# EAGLE design quantizer-main (EAGLE 6.6.0)
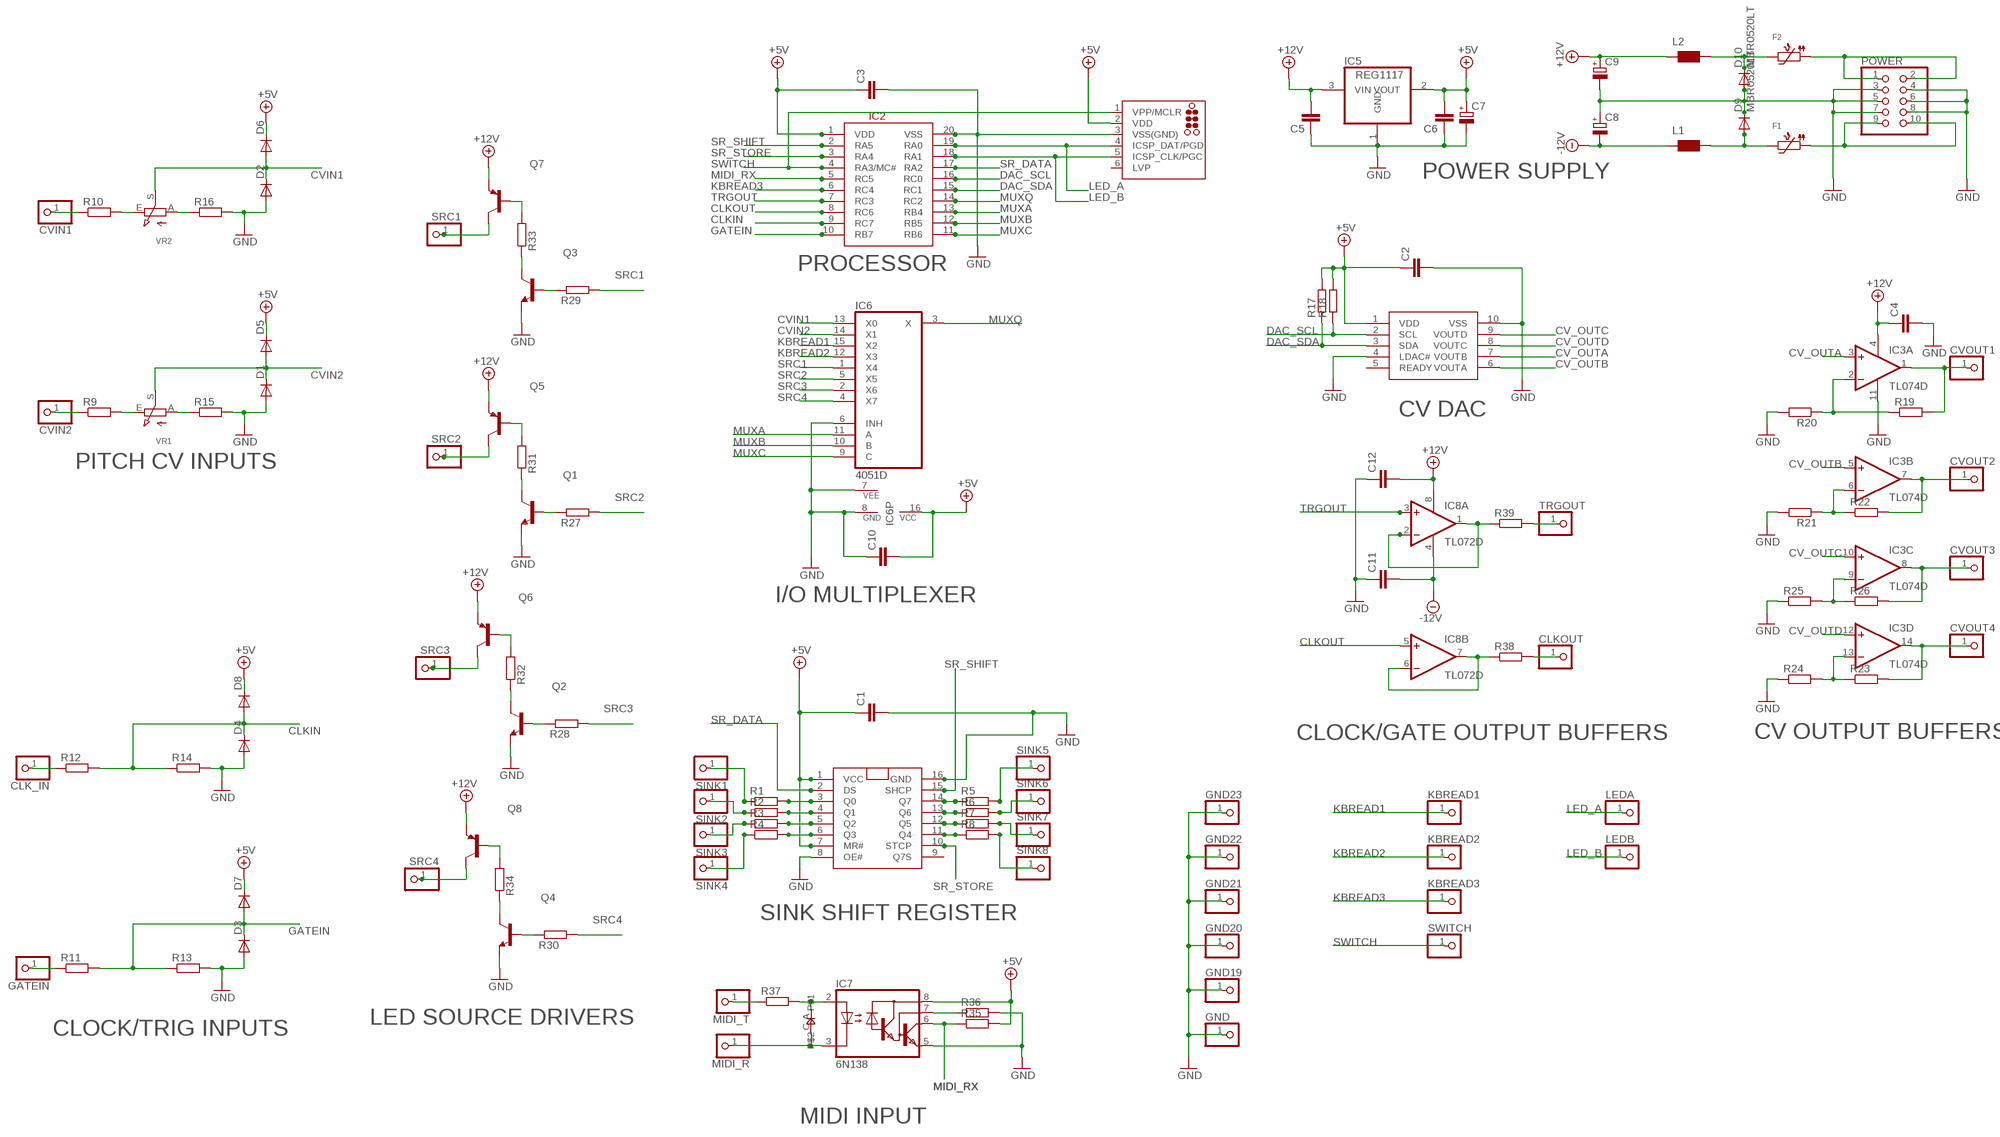
[diagram p0: schematic, sheet 1]

## Parts
C1  C-EUC0805  [C0805]
C2  C-EUC0805  [C0805]
C3  C-EUC0805  [C0805]
C4  C-EUC0805  [C0805]
C5  C-EUC0805  [C0805]
C6  C-EUC0805  [C0805]
C7  CPOL-EUE2.5-5  [E2,5-5]
C8  CPOL-EUE2.5-7  [E2,5-7]
C9  CPOL-EUE2.5-7  [E2,5-7]
C10  C-EUC0805  [C0805]
C11  C-EUC0805  [C0805]
C12  C-EUC0805  [C0805]
CLK_IN  PINHD-1X1  [1X01]
CLKOUT  PINHD-1X1  [1X01]
CVIN1  PINHD-1X1  [1X01]
CVIN2  PINHD-1X1  [1X01]
CVOUT1  PINHD-1X1  [1X01]
CVOUT2  PINHD-1X1  [1X01]
CVOUT3  PINHD-1X1  [1X01]
CVOUT4  PINHD-1X1  [1X01]
D1  DIODE-SOD123  [SOD123]
D2  DIODE-SOD123  [SOD123]
D3  DIODE-SOD123  [SOD123]
D4  DIODE-SOD123  [SOD123]
D5  DIODE-SOD123  [SOD123]
D6  DIODE-SOD123  [SOD123]
D7  DIODE-SOD123  [SOD123]
D8  DIODE-SOD123  [SOD123]
D9  MBR0520LT  [SOD123]
D10  MBR0520LT  [SOD123]
D11  0805DIODE  [0805DIODE]
F1  PTC1210  [PTC1210]
F2  PTC1210  [PTC1210]
GATEIN  PINHD-1X1  [1X01]
GND  PINHD-1X1  [1X01]
GND19  PINHD-1X1  [1X01]
GND20  PINHD-1X1  [1X01]
GND21  PINHD-1X1  [1X01]
GND22  PINHD-1X1  [1X01]
GND23  PINHD-1X1  [1X01]
IC1  NPIC6C596  [SO16]
IC2  PIC16F1829SOIC  [SO20W]
IC3  TL074D  [SO14]
IC4  MCP4728_QUAD_DAC  [MSOP10]
IC5  REG1117  [SOT223]
IC6  4051D  [SO16]
IC7  6N138  [DIL08]
IC8  TL072D  [SO08]
J1  TC2030-MCP-NL  [TC2030-MCP-NL]
KBREAD1  PINHD-1X1  [1X01]
KBREAD2  PINHD-1X1  [1X01]
KBREAD3  PINHD-1X1  [1X01]
L1  WE-CBF_0805  [0805]
L2  WE-CBF_0805  [0805]
LEDA  PINHD-1X1  [1X01]
LEDB  PINHD-1X1  [1X01]
MIDI_R  PINHD-1X1  [1X01]
MIDI_T  PINHD-1X1  [1X01]
POWER  PINHD-2X5  [2X05]
Q1  MMBT3904LT1-NPN-SOT23-BEC  [SOT23-BEC]
Q2  MMBT3904LT1-NPN-SOT23-BEC  [SOT23-BEC]
Q3  MMBT3904LT1-NPN-SOT23-BEC  [SOT23-BEC]
Q4  MMBT3904LT1-NPN-SOT23-BEC  [SOT23-BEC]
Q5  MMBT3906LT1-PNP-SOT23-BEC  [SOT23-BEC]
Q6  MMBT3906LT1-PNP-SOT23-BEC  [SOT23-BEC]
Q7  MMBT3906LT1-PNP-SOT23-BEC  [SOT23-BEC]
Q8  MMBT3906LT1-PNP-SOT23-BEC  [SOT23-BEC]
R1  R-EU_R0805  [R0805]
R2  R-EU_R0805  [R0805]
R3  R-EU_R0805  [R0805]
R4  R-EU_R0805  [R0805]
R5  R-EU_R0805  [R0805]
R6  R-EU_R0805  [R0805]
R7  R-EU_R0805  [R0805]
R8  R-EU_R0805  [R0805]
R9  R-EU_R0805  [R0805]
R10  R-EU_R0805  [R0805]
R11  R-EU_R0805  [R0805]
R12  R-EU_R0805  [R0805]
R13  R-EU_R0805  [R0805]
R14  R-EU_R0805  [R0805]
R15  R-EU_R0805  [R0805]
R16  R-EU_R0805  [R0805]
R17  R-EU_R0805  [R0805]
R18  R-EU_R0805  [R0805]
R19  R-EU_R0805  [R0805]
R20  R-EU_R0805  [R0805]
R21  R-EU_R0805  [R0805]
R22  R-EU_R0805  [R0805]
R23  R-EU_R0805  [R0805]
R24  R-EU_R0805  [R0805]
R25  R-EU_R0805  [R0805]
R26  R-EU_R0805  [R0805]
R27  R-EU_R0805  [R0805]
R28  R-EU_R0805  [R0805]
R29  R-EU_R0805  [R0805]
R30  R-EU_R0805  [R0805]
R31  R-EU_R0805  [R0805]
R32  R-EU_R0805  [R0805]
R33  R-EU_R0805  [R0805]
R34  R-EU_R0805  [R0805]
R35  R-EU_R0805  [R0805]
R36  R-EU_R0805  [R0805]
R37  R-EU_R0805  [R0805]
R38  R-EU_R0805  [R0805]
R39  R-EU_R0805  [R0805]
SINK1  PINHD-1X1  [1X01]
SINK2  PINHD-1X1  [1X01]
SINK3  PINHD-1X1  [1X01]
SINK4  PINHD-1X1  [1X01]
SINK5  PINHD-1X1  [1X01]
SINK6  PINHD-1X1  [1X01]
SINK7  PINHD-1X1  [1X01]
SINK8  PINHD-1X1  [1X01]
SRC1  PINHD-1X1  [1X01]
SRC2  PINHD-1X1  [1X01]
SRC3  PINHD-1X1  [1X01]
SRC4  PINHD-1X1  [1X01]
SWITCH  PINHD-1X1  [1X01]
TRGOUT  PINHD-1X1  [1X01]
VR1  TRIMPOT10K_BOURNS  [TRIMPOT_BOURNS3MM]
VR2  TRIMPOT10K_BOURNS  [TRIMPOT_BOURNS3MM]

## Nets
+5V: C1.1 C2.1 C3.1 C6.2 C7.+ C10.2 D5.C D6.C D7.C D8.C IC1.1(VCC) IC1.7(MR#) IC2.1(VDD) IC4.1(VDD) IC5.2(VOUT) IC6.16(VCC) IC7.8(VCC) J1.2(VDD) R17.2 R18.2 R35.2
+12V: C4.1 C5.2 C9.+ C12.2 IC3.4(P:V+) IC5.3(VIN) IC8.8(P:V+) L2.1 Q5.E Q6.E Q7.E Q8.E
-12V: C8.- C11.2 IC8.4(P:V-) L1.1
CLKIN: D4.C D8.A IC2.9(RC7) R12.2 R14.1
CLKOUT: IC2.8(RC6) IC8.5(B:+IN)
CV_OUTA: IC3.3(A:+IN) IC4.7(VOUTB)
CV_OUTB: IC3.5(B:+IN) IC4.6(VOUTA)
CV_OUTC: IC3.10(C:+IN) IC4.9(VOUTD)
CV_OUTD: IC3.12(D:+IN) IC4.8(VOUTC)
CVIN1: D2.C D6.A IC6.13(X0) VR2.S
CVIN2: D1.C D5.A IC6.14(X1) VR1.S
DAC_SCL: IC2.16(RC0) IC4.2(SCL) R18.1
DAC_SDA: IC2.15(RC1) IC4.3(SDA) R17.1
GATEIN: D3.C D7.A IC2.10(RB7) R11.2 R13.1
GND: C1.2 C2.2 C3.2 C4.2 C5.1 C6.1 C7.- C8.+ C9.- C10.1 C11.1 C12.1 D1.A D2.A D3.A D4.A D9.C D10.A GND19.1 GND20.1 GND21.1 GND22.1 GND23.1 GND.1 IC1.8(OE#) IC1.16(GND) IC2.20(VSS) IC3.11(P:V-) IC4.4(LDAC#) IC4.10(VSS) IC5.1(GND) IC6.6(INH) IC6.7(VEE) IC6.8(GND) IC7.5(GND) J1.3(VSS(GND)) POWER.3 POWER.4 POWER.5 POWER.6 POWER.7 POWER.8 Q1.E Q2.E Q3.E Q4.E R13.2 R14.2 R15.2 R16.2 R20.2 R21.2 R24.1 R25.1 R36.2
KBREAD1: IC6.15(X2) KBREAD1.1
KBREAD2: IC6.12(X3) KBREAD2.1
KBREAD3: IC2.6(RC4) KBREAD3.1
LED_A: IC2.19(RA0) J1.4(ICSP_DAT/PGD) LEDA.1
LED_B: IC2.18(RA1) J1.5(ICSP_CLK/PGC) LEDB.1
MIDI_RX: IC2.5(RC5) IC7.6(VO) R35.1
MUXA: IC2.13(RB4) IC6.11(A)
MUXB: IC2.12(RB5) IC6.10(B)
MUXC: IC2.11(RB6) IC6.9(C)
MUXQ: IC2.14(RC2) IC6.3(X)
N$1: CVOUT1.1 IC3.1(A:OUT) R19.2
N$2: IC3.2(A:-IN) R19.1 R20.1
N$3: R1.1 SINK1.1
N$4: IC3.6(B:-IN) R21.1 R22.1
N$5: CVOUT2.1 IC3.7(B:OUT) R22.2
N$6: R2.1 SINK2.1
N$7: R3.1 SINK3.1
N$8: R4.1 SINK4.1
N$9: CVOUT3.1 IC3.8(C:OUT) R26.2
N$10: CVOUT4.1 IC3.14(D:OUT) R23.2
N$11: IC3.9(C:-IN) R25.2 R26.1
N$12: IC3.13(D:-IN) R23.1 R24.2
N$13: IC1.3(Q0) R1.2
N$14: IC1.4(Q1) R2.2
N$15: IC1.5(Q2) R3.2
N$16: IC1.6(Q3) R4.2
N$17: R5.2 SINK5.1
N$18: R6.2 SINK6.1
N$19: R7.2 SINK7.1
N$20: R8.2 SINK8.1
N$21: IC1.14(Q7) R5.1
N$22: IC1.13(Q6) R6.1
N$23: IC1.12(Q5) R7.1
N$24: IC1.11(Q4) R8.1
N$25: Q7.C SRC1.1
N$26: Q3.B R29.1
N$27: MIDI_T.1 R37.1
N$28: Q7.B R33.2
N$29: Q5.C SRC2.1
N$30: Q1.B R27.1
N$31: D11.A IC7.2(A) R37.2
N$32: Q3.C R33.1
N$33: Q5.B R31.2
N$34: Q1.C R31.1
N$35: D11.C IC7.3(C) MIDI_R.1
N$36: Q6.C SRC3.1
N$37: Q2.B R28.1
N$38: Q6.B R32.2
N$39: Q2.C R32.1
N$40: Q8.C SRC4.1
N$41: D10.C F2.P$2 L2.2
N$42: D9.A F1.P$2 L1.2
N$44: Q4.B R30.1
N$45: Q8.B R34.2
N$46: CLK_IN.1 R12.1
N$47: IC7.7(VB) R36.1
N$48: Q4.C R34.1
N$50: GATEIN.1 R11.1
N$53: CVIN2.1 R9.1
N$54: R9.2 VR1.E
N$55: R15.1 VR1.A
N$56: CVIN1.1 R10.1
N$57: R10.2 VR2.E
N$58: R16.1 VR2.A
N$60: IC8.1(A:OUT) IC8.2(A:-IN) R39.1
N$61: IC8.6(B:-IN) IC8.7(B:OUT) R38.1
N$63: F1.P$1 POWER.9 POWER.10
N$64: R39.2 TRGOUT.1
N$65: CLKOUT.1 R38.2
N$75: F2.P$1 POWER.1 POWER.2
SR_DATA: IC1.2(DS) IC2.17(RA2)
SR_SHIFT: IC1.15(SHCP) IC2.2(RA5)
SR_STORE: IC1.10(STCP) IC2.3(RA4)
SRC1: IC6.1(X4) R29.2
SRC2: IC6.5(X5) R27.2
SRC3: IC6.2(X6) R28.2
SRC4: IC6.4(X7) R30.2
SWITCH: IC2.4(RA3/MC#) J1.1(VPP/MCLR) SWITCH.1
TRGOUT: IC2.7(RC3) IC8.3(A:+IN)
Unconnected: IC1.9(Q7S) IC4.5(READY) J1.6(LVP)

## Notes on the sheet
- POWER SUPPLY
- PROCESSOR
- CV DAC
- PITCH CV INPUTS
- I/O MULTIPLEXER
- CLOCK/GATE OUTPUT BUFFERS | CV OUTPUT BUFFERS
- SINK SHIFT REGISTER
- LED SOURCE DRIVERS
- CLOCK/TRIG INPUTS
- MIDI INPUT

## Library data of the parts
C1-C6 C10-C12 = rcl:C-EU: CAPACITOR, European symbol
C7-C9 = rcl:CPOL-EU: POLARIZED CAPACITOR, European symbol
CLK_IN CLKOUT CVIN1 CVIN2 CVOUT1-CVOUT4 GATEIN GND GND19-GND23 KBREAD1-KBREAD3 LEDA LEDB MIDI_R MIDI_T SINK1-SINK8 SRC1-SRC4 SWITCH TRGOUT = pinhead:PINHD-1X1: PIN HEADER
D1-D8 = diode:DIODE-: DIODE
D9 D10 = diode:MBR0520LT: SCHOTTKY BARRIER RECTIFIER Source: http://onsemi.com .. MBR0520LT1-D.pdf
D11 = jasons_stuff:0805DIODE
F1 F2 = microbuilder:PTC: PTC (Resettable Fuse) 1206 Package 250mA PTC (16V Max, Time-to-Trip: 0.08s) - Digikey: F2110CT-ND 1210 Package 100mA PTC (30V Max, Time-to-Trip: 0.6s) - Digikey: MF-USMF010-2CT-ND 1812 Package 750mA PTC (24V Max, Time-to-Trip: 0.2s) - Digikey: MF-MSMF075/24-2CT-ND
IC1 = jasons_stuff:NPIC6C596
IC2 = jason_eagle6:PIC16F1829
IC3 = linear:TL074: OP AMP
IC4 = jason_eagle6:MCP4728_QUAD_DAC
IC5 = burr-brown:REG1117: 800mA and 1A Low Dropout (LDO) Positive Regulator 1.8V, 2.5V, 2.85V, 3.3V, 5V, and Adj; MPN: REG1117; OC_FARNELL: 1097566; OC_NEWARK: 14P6981
IC6 = 40xx:4051: 8-channel ANALOG MULTIPLEXER
IC7 = optocoupler:6N138: MOTOROLA OPTO COUPLER; MF: VISHAY/TELEFUNKEN; MPN: 6N138; OC_FARNELL: 9860150; OC_NEWARK: 35K5294
IC8 = linear:TL072: OP AMP
J1 = tag-connect:TC2030: TAG-CONNECT ICSP Connector Manufacturer: Tag-Connect <http://www.tag-connect.com> Cable for easy In-Circuit Serial Programming. Designed for Microchip ICD2, suitable for many others. Two variants - one "with legs" (for hands-free fit on PCB) and another "without legs" for quick programming. PAD Description 1 MCLR/Vpp 2 Vdd 3 GND 4 PGD (ISPDAT) 5 PGC (ISPCLK) 6 nc (used for LVP) ©2009 ROFA.cz - modified and updated by Robert Darlington ‹rdarlington@gmail.com›
L1 L2 = wuerth-elektronik:WE-CBF: SMD EMI Suppression Ferrite Beads - excellent anti-EMI properties - low DCR - impedances till 3000 ohms - rated current up to 6 A
POWER = pinhead:PINHD-2X5: PIN HEADER
Q1-Q4 = transistor:*-NPN-: NPN Transistror BF959 corrected 2008.03.06
Q5-Q8 = transistor:*-PNP-: PNP Transistror
R1-R39 = rcl:R-EU_: RESISTOR, European symbol
VR1 VR2 = microbuilder:TRIMPOT: Potentiometers 3mm 10K Single Turn - Digikey: 3303W-103ETR-ND 3mm 100K Single Turn - Digikey: 3303X-104ETR-ND

## Board
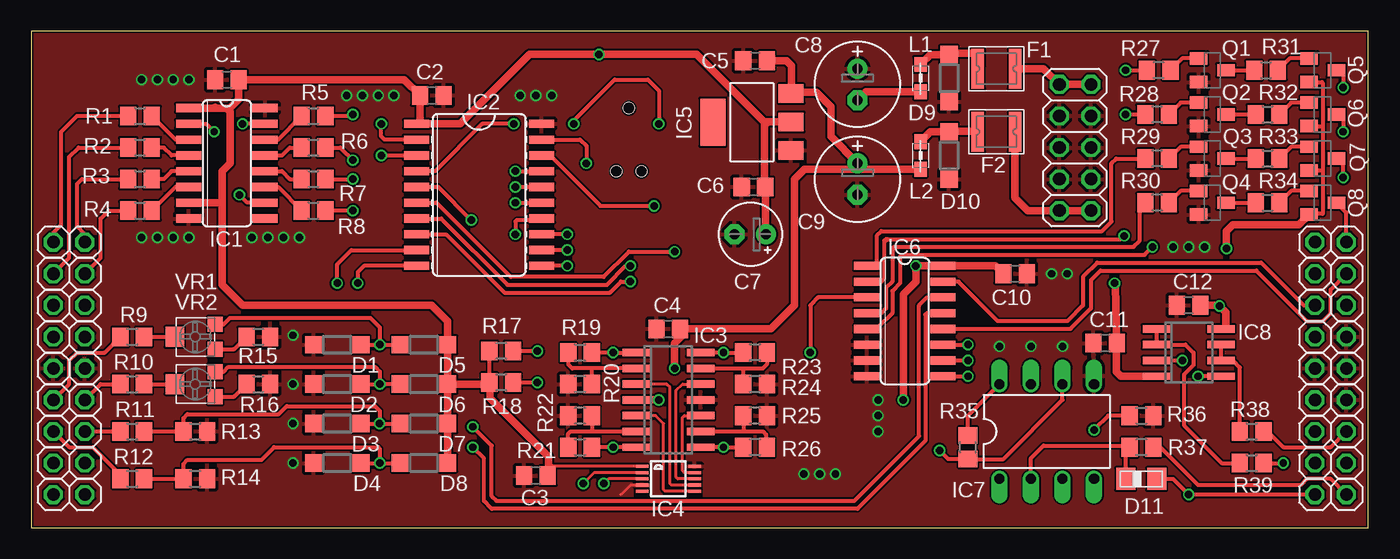
[diagram p1: board, top side]
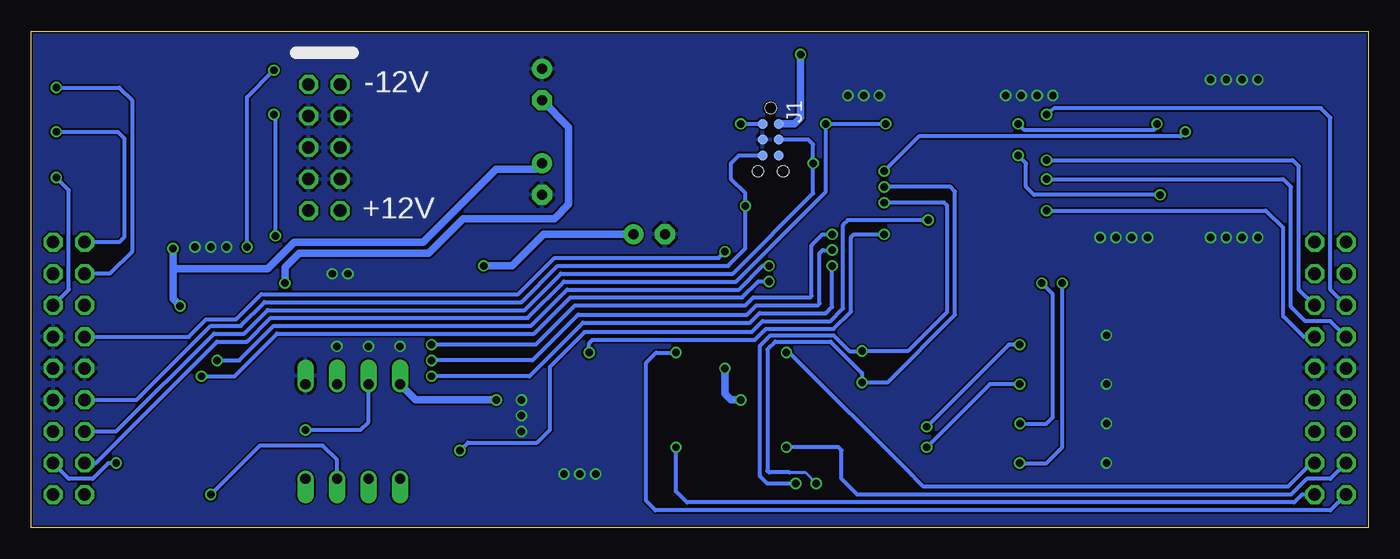
[diagram p2: board, bottom side, seen from below]

Size 107.71 x 39.98 mm. Coordinates in mm from the lower left corner, seen from the top.
Outline: 0,0 107.71,0 107.71,39.98 0,39.98 0,0
Copper layers (1*16): Top 0.035mm / dielectric 1.5mm / Bottom 0.035mm
Design rules "hackvana": minimum track width 6mil, minimum drill 0.3mm, track to track 6mil, track to pad 9mil, pad to pad 6mil, via to via 6mil, smd to smd 0mil, copper to edge 6mil, drill to drill 6mil, minimum pad ring 10mil, minimum via ring 6mil, stop-mask expansion 2mil, vias tented up to drill 100mil, thermal gap 10mil

### Footprints (pad centres in the part's own frame; a part is rotated, then mirrored left to right if it is on the bottom)
C0805 = smd 1.3 x 1.5: 1 -0.95,0; 2 0.95,0
E2,5-5 = drill 0.813 pad 1.6: + -1.27,0 | drill 0.813 pad 1.6 octagon: - 1.27,0
E2,5-7 = drill 0.813 pad 1.6: + -1.27,0 | drill 0.813 pad 1.6 octagon: - 1.27,0
1X01 = drill 1.016 octagon: 1 0,0
SOD123 = smd 1.4 x 1.4: A 1.9,0; C -1.9,0
0805DIODE = smd 1.524 x 1.778: A -1.262,-0.005; C 1.238,-0.005
PTC1210 = smd 1 x 3.2: P$1 -1.5,0; P$2 1.5,0
SO16 = smd 0.66 x 2.032: 1 -4.445,-3.073; 2 -3.175,-3.073; 3 -1.905,-3.073; 4 -0.635,-3.073; 5 0.635,-3.073; 6 1.905,-3.073; 7 3.175,-3.073; 8 4.445,-3.073; 9 4.445,3.073; 10 3.175,3.073; 11 1.905,3.073; 12 0.635,3.073; 13 -0.635,3.073; 14 -1.905,3.073; 15 -3.175,3.073; 16 -4.445,3.073
SO20W = smd 0.66 x 2.032: 1 -5.715,-5.029; 2 -4.445,-5.029; 3 -3.175,-5.029; 4 -1.905,-5.029; 5 -0.635,-5.029; 6 0.635,-5.029; 7 1.905,-5.029; 8 3.175,-5.029; 9 4.445,-5.029; 10 5.715,-5.029; 11 5.715,5.029; 12 4.445,5.029; 13 3.175,5.029; 14 1.905,5.029; 15 0.635,5.029; 16 -0.635,5.029; 17 -1.905,5.029; 18 -3.175,5.029; 19 -4.445,5.029; 20 -5.715,5.029
SO14 = smd 0.6 x 2.2: 1 -3.81,-2.6; 2 -2.54,-2.6; 3 -1.27,-2.6; 4 0,-2.6; 5 1.27,-2.6; 6 2.54,-2.6; 7 3.81,-2.6; 8 3.81,2.6; 9 2.54,2.6; 10 1.27,2.6; 11 0,2.6; 12 -1.27,2.6; 13 -2.54,2.6; 14 -3.81,2.6
MSOP10 = smd 0.25 x 1: 1 -1,-2.113; 2 -0.5,-2.113; 3 0,-2.113; 4 0.5,-2.113; 5 1,-2.113; 6 1,2.113; 7 0.5,2.113; 8 0,2.113; 9 -0.5,2.113; 10 -1,2.113
SOT223 = smd 1.499 x 2.007: 1 -2.261,-3.15; 2 0.025,-3.15; 3 2.311,-3.15 | smd 3.81 x 2.007: 4 0,3.15
DIL08 = drill 0.813 offset: 1 -3.81,-3.81; 2 -1.27,-3.81; 3 1.27,-3.81; 4 3.81,-3.81; 5 3.81,3.81; 6 1.27,3.81; 7 -1.27,3.81; 8 -3.81,3.81
SO08 = smd 0.6 x 2.2: 1 -1.905,-2.6; 2 -0.635,-2.6; 3 0.635,-2.6; 4 1.905,-2.6; 5 1.905,2.6; 6 0.635,2.6; 7 -0.635,2.6; 8 -1.905,2.6
TC2030-MCP-NL = smd 0.787 x 0.787: 1 1.27,-0.635; 2 1.27,0.635; 3 2.54,-0.635; 4 2.54,0.635; 5 3.81,-0.635; 6 3.81,0.635 | hole 0.889: 0,0; 5.08,-1.016; 5.08,1.016
0805 = smd 1.2 x 1: 1 -1.1,0; 2 1.1,0
2X05 = drill 1.016 octagon: 1 -5.08,-1.27; 2 -5.08,1.27; 3 -2.54,-1.27; 4 -2.54,1.27; 5 0,-1.27; 6 0,1.27; 7 2.54,-1.27; 8 2.54,1.27; 9 5.08,-1.27; 10 5.08,1.27
SOT23-BEC = smd 1 x 1.4: B -0.95,-1.1; C 0,1.1; E 0.95,-1.1
R0805 = smd 1.3 x 1.5: 1 -0.95,0; 2 0.95,0
TRIMPOT_BOURNS3MM = smd 1.2 x 1.2: A -1,-1.6; S 1,-1.6 | smd 1.6 x 1.5: E 0,1.65

### Placement (x,y rotation side)
C1  15.77,36.07 180 top
C2  32.28,34.8 0 top
C3  40.66,4.19 180 top
C4  51.33,16 180 top
C5  58.31,37.59 0 top
C6  58.18,27.43 0 top
C7  57.93,23.62 180 top
C8  66.57,35.69 270 top
C9  66.57,28.07 270 top
C10  79.27,20.45 180 top
C11  86.51,14.86 0 top
C12  93.24,17.91 0 top
CLK_IN  1.8,7.75 0 top
CLKOUT  105.94,7.75 0 top
CVIN1  4.34,10.29 0 top
CVIN2  1.8,10.29 0 top
CVOUT1  4.34,5.21 0 top
CVOUT2  1.8,5.21 0 top
CVOUT3  4.34,2.67 0 top
CVOUT4  1.8,2.67 0 top
D1  24.66,14.73 180 top
D2  24.66,11.56 180 top
D3  24.66,8.38 180 top
D4  24.66,5.21 180 top
D5  31.64,14.73 180 top
D6  31.64,11.56 180 top
D7  31.64,8.38 180 top
D8  31.64,5.21 180 top
D9  73.93,36.2 90 top
D10  73.93,29.97 270 top
D11  89.43,3.94 0 top
F1  77.74,36.96 180 top
F2  77.74,31.88 180 top
GATEIN  4.34,7.75 0 top
GND  103.4,12.83 0 top
GND19  105.94,15.37 0 top
GND20  105.94,12.83 0 top
GND21  105.94,10.29 0 top
GND22  4.34,12.83 0 top
GND23  1.8,12.83 0 top
IC1  15.77,29.34 270 top
IC2  36.09,26.8 270 top
IC3  51.33,10.29 270 top
IC4  51.33,3.94 270 top
IC5  58.06,32.64 90 top
IC6  70.38,16.64 270 top
IC7  81.81,7.75 0 top
IC8  93.24,14.1 270 top
J1  48.15,33.78 270 bottom
KBREAD1  103.4,17.91 0 top
KBREAD2  105.94,20.45 0 top
KBREAD3  103.4,15.37 0 top
L1  71.65,36.2 90 top
L2  71.65,29.97 90 top
LEDA  103.4,7.75 0 top
LEDB  103.4,10.29 0 top
MIDI_R  103.4,2.67 0 top
MIDI_T  105.94,2.67 0 top
POWER  84.09,30.61 90 top
Q1  95.14,36.83 270 top
Q2  95.14,33.27 270 top
Q3  95.14,29.72 270 top
Q4  95.14,26.16 270 top
Q5  104.03,36.83 270 top
Q6  104.03,33.27 270 top
Q7  104.03,29.72 270 top
Q8  104.03,26.16 270 top
R1  8.78,33.15 0 top
R2  8.78,30.61 0 top
R3  8.78,28.07 0 top
R4  8.78,25.53 0 top
R5  22.75,33.15 0 top
R6  22.75,30.61 0 top
R7  22.75,28.07 0 top
R8  22.75,25.53 0 top
R9  8.15,15.37 0 top
R10  8.15,11.56 0 top
R11  8.15,7.75 0 top
R12  8.15,3.94 0 top
R13  13.23,7.75 0 top
R14  13.23,3.94 0 top
R15  18.31,15.37 0 top
R16  18.31,11.56 0 top
R17  37.86,14.22 180 top
R18  37.86,11.68 180 top
R19  44.21,14.1 0 top
R20  44.21,11.56 180 top
R21  44.21,9.02 180 top
R22  44.21,6.48 0 top
R23  58.31,14.1 180 top
R24  58.31,11.56 180 top
R25  58.31,9.02 180 top
R26  58.31,6.48 180 top
R27  90.82,36.83 180 top
R28  90.7,33.27 180 top
R29  90.7,29.72 180 top
R30  90.7,26.16 180 top
R31  99.46,36.83 0 top
R32  99.59,33.27 0 top
R33  99.59,29.72 0 top
R34  99.59,26.16 0 top
R35  75.46,6.48 90 top
R36  89.43,9.02 0 top
R37  89.43,6.48 180 top
R38  98.32,7.75 0 top
R39  98.32,5.21 0 top
SINK1  1.8,22.99 0 top
SINK2  1.8,20.45 0 top
SINK3  4.34,22.99 0 top
SINK4  4.34,20.45 0 top
SINK5  1.8,17.91 0 top
SINK6  4.34,17.91 0 top
SINK7  1.8,15.37 0 top
SINK8  4.34,15.37 0 top
SRC1  105.94,17.91 0 top
SRC2  103.4,20.45 0 top
SRC3  103.4,22.99 0 top
SRC4  105.94,22.99 0 top
SWITCH  103.4,5.21 0 top
TRGOUT  105.94,5.21 0 top
VR1  13.23,15.37 90 top
VR2  13.23,11.56 90 top

### Tracks (layer width: path | path; a pad name or v marks a point on that pad's centre or on a via)
+5V  (via drill 0.6)
  Top 0.254: IC4.1 41.94,4.94
  Top 0.305: R18.2 R17.2 | 41.94,4.94 41.67,5.21 | R35.2 75.46,9.02 IC7.8
  Top 0.61: D8.C D7.C 33.54,9.02 | 33.54,9.02 D6.C | D6.C D5.C 33.55,16.64 32.28,17.91 17.04,17.91 15.39,19.56 15.39,26.16 | IC1.7 15.39,26.16 | 15.89,33.66 16.02,33.53 16.02,29.34 15.39,28.7 15.39,26.16 | 15.89,33.66 15.77,33.78 14.88,33.78 | 14.88,33.78 IC1.1 | 14.82,33.84 14.88,33.78 | IC5.2 59.35,32.66 | 59.35,32.66 59.07,32.39 59.07,27.49 C6.2 59.13,23.69 C7.+ | 33.55,7.75 33.55,9.01 33.54,9.02 | C10.2 77.68,21.08 IC6.16 v71.27,21.08 71.27,19.81 70.25,18.8 v70.25,10.29 | 31.33,32.78 C2.1 30.06,36.07 C1.1 16.72,34.48 15.89,33.66 | 31.33,32.78 IC2.1 | 31.33,32.78 31.33,32.58 31.26,32.51 34.56,32.51 40.15,38.1 v45.74,38.1 53.61,38.1 59.05,32.66 59.35,32.66 | C3.1 41.67,4.26 41.67,5.21 41.67,5.72 36.98,10.41 36.98,11.62 R18.2 36.79,11.56 D6.C
  Bottom 0.61: C7.+ 66.44,23.62 68.98,21.08 v71.27,21.08 | J1.2 46.25,32.51 45.74,33.02 v45.74,38.1 | v70.25,10.29 76.73,10.29 IC7.8
+12V  (via drill 0.6)
  Top 0.305: Q5.E 103.97,35.88 104.03,35.81 104.03,32.39 | 104.03,32.39 104.03,28.83 | 104.03,28.83 104.03,25.27 102.99,25.27 Q8.E | Q7.E 103.97,28.77 104.03,28.83 | Q6.E 103.97,32.32 104.03,32.39
  Top 0.61: C5.2 60.85,37.59 61.23,37.21 61.23,34.98 IC5.3 61.31,35.05 63.26,35.05 64.41,33.91 64.41,31.5 C9.+ 67.03,28.87 | L2.1 67.03,28.87 | 67.03,28.87 62.29,28.87 61.49,28.07 61.49,17.91 59.58,16 52.47,16 52.47,15.81 | v50.56,10.29 IC3.4 | IC8.8 96.41,16 96.22,16.2 96.22,17.34 v95.71,17.85 95.65,17.91 C12.2 | 52.09,16 C4.1 52.47,15.81 | v51.83,12.83 51.83,14.86 52.47,15.49 52.47,15.81 | v96.28,22.48 96.28,23.88 96.79,24.38 102.1,24.38 Q8.E
  Bottom 0.61: v96.28,22.48 96.28,20.83 | 96.28,20.83 96.28,18.42 v95.71,17.85 | C9.+ 67.03,28.87 70.25,28.87 76.13,22.99 86.51,22.99 88.66,20.83 96.28,20.83 | v50.56,10.29 51.33,10.29 51.83,10.8 v51.83,12.83
-12V  (via drill 0.6)
  Top 0.61: L1.1 67.24,35.09 C8.- | IC8.4 87.78,12.19 87.39,12.57 87.39,14.03 C11.2 87.33,19.5 v87.27,19.69
  Bottom 0.61: v87.27,19.69 87.27,20.96 86.12,22.1 75.71,22.1 72.92,24.89 65.55,24.89 64.41,26.04 64.41,32.26 C8.-
CLKIN  (via drill 0.6)
  Top 0.305: R12.2 R14.1 12.28,5.15 12.59,5.46 18.56,5.46 19.58,6.48 27.96,6.48 28.09,6.35 v28.09,5.21 | v28.09,5.21 D4.C | v28.09,5.21 D8.A | v24.66,19.69 24.66,21.21 25.8,22.35 IC2.9
  Bottom 0.305: v28.09,5.21 25.93,5.21 24.66,6.48 v24.66,19.69
CLKOUT  (via drill 0.6)
  Top 0.305: IC8.5 v94,12.19 | IC2.8 33.42,23.62 38.12,18.92 46.63,18.92 47.52,19.81 v48.28,19.81
  Bottom 0.305: v94,12.19 91.33,12.19 87.9,15.62 67.2,15.62 64.28,18.54 50.44,18.54 49.17,19.81 v48.28,19.81
CV_OUTA
  Top 0.254: IC3.3 51.2,11.56 51.45,11.3 51.45,3.56 51.57,3.44 IC4.7
CV_OUTB
  Top 0.254: IC3.5 50.31,9.02 50.95,8.38 50.95,3.05 51.06,2.94 IC4.6
CV_OUTC
  Top 0.254: IC4.9 52.6,4.44 52.47,4.57 52.47,8.89 52.6,9.02 IC3.10
CV_OUTD
  Top 0.254: IC3.12 52.47,11.56 51.96,11.05 51.96,4.06 52.09,3.94 IC4.8
CVIN1  (via drill 0.6)
  Top 0.305: v28.09,11.56 D2.C | VR2.S 15.5,12.56 15.89,12.95 27.7,12.95 28.09,12.57 v28.09,11.56 | D6.A v28.09,11.56 | IC6.13 72.15,17.27 72.03,17.15 72.03,6.99 66.57,1.52 37.1,1.52 36.47,2.16 36.47,5.59 v35.58,6.48
  Bottom 0.305: v28.09,11.56 30.5,11.56 v35.58,6.48
CVIN2  (via drill 0.6)
  Top 0.305: v28.09,14.73 D1.C | v28.09,14.73 D5.A | IC6.14 72.15,18.54 71.52,17.91 71.52,7.37 66.31,2.16 37.48,2.16 37.1,2.54 37.1,6.6 v35.58,8.13 | VR1.S 15.5,16.37 16.02,16.89 27.32,16.89 28.09,16.13 v28.09,14.73
  Bottom 0.305: v28.09,14.73 28.97,14.73 v35.58,8.13
DAC_SCL  (via drill 0.6)
  Top 0.254: IC4.2 45.35,4.44 v44.47,3.56
  Top 0.305: v39.01,27.43 IC2.16 | v40.79,11.68 R18.1
  Bottom 0.254: 46.63,4.45 45.36,4.45 v44.47,3.56
  Bottom 0.305: v39.01,27.43 33.67,27.43 33.29,27.05 33.29,17.15 38.75,11.68 v40.79,11.68 40.79,12.45 43.33,14.99 47.77,14.99 48.41,14.35 48.41,4.57 48.28,4.45 46.63,4.45
DAC_SDA  (via drill 0.6)
  Top 0.254: IC4.3 46.5,3.94 v46.12,3.56
  Top 0.305: v39.01,26.16 IC2.15 | v40.79,14.22 R17.1
  Bottom 0.305: v39.01,26.16 34.18,26.16 33.93,25.91 33.93,17.4 37.1,14.22 v40.79,14.22 41.8,14.22 43.07,15.49 48.15,15.49 49.04,14.61 49.04,4.19 48.41,3.56 v46.12,3.56
GATEIN  (via drill 0.6)
  Top 0.305: R11.2 R13.1 12.28,8.83 12.59,9.14 19.96,9.14 20.59,9.78 27.7,9.78 28.09,9.4 28.09,8.4 v28.06,8.38 | v28.06,8.38 D3.C | v28.06,8.38 D7.A | IC2.10 26.82,21.08 26.31,20.57 v26.31,19.69
  Bottom 0.305: v28.06,8.38 25.93,8.38 25.42,8.89 25.42,18.8 v26.31,19.69
GND  (via drill 0.6)
  Top 0.254: IC4.4 48.29,3.44 47.52,2.67
  other vias: 21.1,15.49 21.1,11.56 21.1,8.38 21.1,5.21 12.72,36.07 11.45,36.07 10.18,36.07 8.91,36.07 8.91,23.37 10.18,23.37 11.45,23.37 12.72,23.37 29.23,34.8 25.42,34.8 26.69,34.8 27.96,34.8 17.8,23.37 19.07,23.37 20.34,23.37 21.61,23.37 82.19,20.45 83.46,20.45 78,14.61 80.54,14.61 83.08,14.61 91.97,22.61 93.24,22.61 94.51,22.61 68.22,9.02 68.22,7.75 68.22,10.29 39.39,34.8 40.66,34.8 41.93,34.8 62.25,4.32 63.52,4.32 64.79,4.32
  pour Top: -2.01,42.04 -2.01,-6.22 111.02,-6.22 111.02,45.85 -2.01,45.85
  pour Bottom: -5.82,42.04 -5.82,-4.95 111.02,-4.95 111.02,44.58 -5.82,44.58
KBREAD1
  Top 0.305: KBREAD1.1 102.51,17.91 99.08,21.34 85.87,21.34 84.73,20.19 84.73,17.91 83.46,16.64 77.87,16.64 74.69,19.81 IC6.15
KBREAD2
  Top 0.305: IC6.12 83.71,16 85.36,17.65 85.36,19.94 86.12,20.7 98.7,20.7 102.76,16.64 104.03,16.64 104.67,17.27 104.67,19.18 KBREAD2.1
KBREAD3  (via drill 0.6)
  Top 0.305: IC2.6 32.66,26.16 38.63,20.19 46.12,20.19 48.15,22.23 v51.83,22.23
  Bottom 0.305: KBREAD3.1 95.01,15.37 93.62,16.76 91.2,16.76 89.17,18.8 68.47,18.8 65.55,21.72 52.34,21.72 v51.83,22.23
LED_A  (via drill 0.6)
  Top 0.305: IC2.19 44.21,31.24 44.72,30.73 v44.72,29.34
  Bottom 0.305: LEDA.1 100.86,7.75 92.98,15.62 90.57,15.62 88.66,17.53 67.96,17.53 65.04,20.45 51.2,20.45 44.72,26.92 v44.72,29.34 44.72,30.86 45.1,31.24 J1.4
LED_B  (via drill 0.6)
  Top 0.305: IC2.18 41.8,29.97 45.87,25.91 v50.18,25.91
  Bottom 0.305: LEDB.1 99.21,10.29 93.24,16.26 90.82,16.26 88.92,18.16 68.22,18.16 65.3,21.08 51.58,21.08 50.18,22.48 v50.18,25.91 50.18,26.8 50.18,26.92 51.33,28.07 51.33,29.34 50.69,29.97 J1.5
MIDI_RX  (via drill 0.6)
  Top 0.305: IC2.5 32.78,27.43 v35.45,24.77 | v73.17,6.22 73.87,5.53 R35.1 78.32,5.53 83.08,10.29 IC7.6
  Bottom 0.305: v35.45,24.77 41.93,24.77 42.31,24.38 42.31,17.65 43.33,16.64 48.79,16.64 49.68,15.75 63.14,15.75 65.93,12.95 65.93,7.87 66.95,6.86 72.54,6.86 v73.17,6.22
MUXA  (via drill 0.6)
  Top 0.305: IC6.11 v75.46,14.73 | v43.2,23.62 IC2.13
  Bottom 0.305: v75.46,14.73 67.07,14.73 63.9,17.91 50.18,17.91 49.55,18.54 44.98,18.54 44.85,18.67 44.85,22.73 43.96,23.62 v43.2,23.62
MUXB  (via drill 0.6)
  Top 0.305: IC6.10 v75.46,13.46 | v43.2,22.35 IC2.12
  Bottom 0.305: v75.46,13.46 67.33,13.46 63.65,17.15 50.06,17.15 49.29,17.91 44.34,17.91 44.21,18.03 44.21,22.1 43.96,22.35 v43.2,22.35
MUXC  (via drill 0.6)
  Top 0.305: IC6.9 v75.46,12.19 | v43.2,21.08 IC2.11
  Bottom 0.305: v75.46,12.19 67.58,12.19 63.26,16.51 49.8,16.51 49.04,17.27 43.71,17.27 43.2,17.78 v43.2,21.08
MUXQ  (via drill 0.6)
  Top 0.305: IC6.3 63.39,18.54 62.76,17.91 v62.76,14.1 | IC2.14 40.99,24.77 39.13,24.77 39.01,24.64 v39.01,23.62
  Bottom 0.305: v62.76,14.1 62.76,14.86 62.5,15.11 49.42,15.11 48.53,16 43.07,16 41.67,17.4 41.67,23.37 41.42,23.62 v39.01,23.62
N$1  (via drill 0.6)
  Top 0.305: R19.2 v46.88,14.1 IC3.1
  Bottom 0.305: v46.88,14.1 46.63,14.1 36.79,4.25 36.47,3.94 35.83,3.3 6.5,3.3 4.59,5.21 CVOUT1.1
N$2
  Top 0.305: IC3.2 45.1,12.83 | 45.1,12.83 43.58,12.83 43.26,13.14 R19.1 | R20.1 45.16,12.77 45.1,12.83
N$3
  Top 0.305: SINK1.1 1.8,23.75 2.43,24.38 2.43,31.88 3.7,33.15 R1.1
N$4
  Top 0.305: R22.1 43.26,7.56 43.45,7.75 45.1,7.75 | 45.1,7.75 IC3.6 | R21.1 45.16,7.81 45.1,7.75
N$5  (via drill 0.6)
  Top 0.305: IC3.7 v46.88,6.48 R22.2
  Bottom 0.305: CVOUT2.1 3.07,3.94 4.97,3.94 6.24,2.67 41.17,2.67 42.44,3.94 42.44,6.22 42.69,6.48 v46.88,6.48
N$6
  Top 0.305: SINK2.1 3.07,21.72 3.07,29.84 3.83,30.61 R2.1
N$7
  Top 0.305: SINK3.1 4.34,23.62 3.7,24.26 3.7,27.69 4.08,28.07 R3.1
N$8
  Top 0.305: SINK4.1 5.61,21.72 5.61,24.89 6.24,25.53 R4.1
N$9  (via drill 0.6)
  Top 0.305: R26.2 v55.77,6.48 IC3.8 53.87,6.48
  Bottom 0.305: v55.77,6.48 55.77,2.92 54.88,2.03 5.99,2.03 5.35,2.67 CVOUT3.1
N$10  (via drill 0.6)
  Top 0.305: R23.2 v55.77,14.1 IC3.14
  Bottom 0.305: v55.77,14.1 R23.2 58.18,13.27 58.18,2.16 57.42,1.4 3.07,1.4 CVOUT4.1
N$11
  Top 0.305: IC3.9 57.3,7.75 | 57.3,7.75 58.95,7.75 59.2,7.49 59.2,6.54 R26.1 | R25.2 57.36,7.81 57.3,7.75
N$12
  Top 0.305: IC3.13 57.3,12.83 | 57.3,12.83 58.95,12.83 59.26,13.14 R23.1 | R24.2 57.36,12.76 57.3,12.83
N$13
  Top 0.305: IC1.3 11.64,31.24 R1.2
N$14
  Top 0.305: IC1.4 11.32,29.97 10.69,30.61 R2.2
N$15
  Top 0.305: IC1.5 11.32,28.7 10.69,28.07 R3.2
N$16
  Top 0.305: IC1.6 11.64,27.43 R4.2
N$17  (via drill 0.6)
  Top 0.305: R5.2 25.8,33.15 v25.93,33.27
  Bottom 0.305: v25.93,33.27 25.29,33.78 3.83,33.78 3.07,33.02 3.07,19.18 SINK5.1
N$18  (via drill 0.6)
  Top 0.305: R6.2 24.91,30.61 v25.93,29.59
  Bottom 0.305: v25.93,29.59 6.11,29.59 5.61,29.08 5.61,19.18 SINK6.1
N$19  (via drill 0.6)
  Top 0.305: R7.2 v25.93,28.07
  Bottom 0.305: v25.93,28.07 6.88,28.07 6.24,27.43 6.24,17.78 5.1,16.64 3.07,16.64 SINK7.1
N$20  (via drill 0.6)
  Top 0.305: v25.93,25.53 R8.2
  Bottom 0.305: SINK8.1 5.23,15.37 6.88,17.02 6.88,24.13 8.27,25.53 v25.93,25.53
N$21
  Top 0.305: IC1.14 19.9,31.24 R5.1
N$22
  Top 0.305: IC1.13 20.21,29.97 20.85,30.61 R6.1
N$23
  Top 0.305: IC1.12 20.21,28.7 20.85,28.07 R7.1
N$24
  Top 0.305: IC1.11 19.9,27.43 R8.1
N$25  (via drill 0.6)
  Top 0.305: v105.68,28.19 105.68,29.17 Q7.C
  Bottom 0.305: SRC1.1 104.67,19.18 104.67,27.18 v105.68,28.19
N$26
  Top 0.305: Q3.B 92.6,30.67 R29.1
N$27
  Top 0.305: MIDI_T.1 104.67,3.94 102.76,3.94 102.25,3.43 94,3.43 90.95,6.48 R37.1
N$28
  Top 0.305: Q7.B 101.49,30.67 R33.2
N$29  (via drill 0.6)
  Top 0.305: Q5.C 105.68,36.83 v105.68,35.43
  Bottom 0.305: SRC2.1 101.36,20.45 99.59,22.23 99.59,34.42 100.6,35.43 v105.68,35.43
N$30
  Top 0.305: Q1.B 92.72,37.78 R27.1
N$31
  Top 0.305: D11.A 88.16,6.17 R37.2 88.35,6.6 81.55,6.6 80.54,5.59 IC7.2
N$32
  Top 0.305: Q3.C R33.1
N$33
  Top 0.305: Q5.B 101.36,37.78 R31.2
N$34
  Top 0.305: Q1.C R31.1
N$35  (via drill 0.6)
  Top 0.305: MIDI_R.1 v93.24,2.67 91.97,3.93 D11.C
  Bottom 0.305: 91.97,3.94 v93.24,2.67 89.3,6.6 84.22,6.6 83.08,5.46 IC7.3
N$36  (via drill 0.6)
  Top 0.305: Q6.C 105.43,33.27 105.68,33.02 v105.68,31.88
  Bottom 0.305: SRC3.1 100.6,22.99 100.22,23.37 100.22,31.37 100.73,31.88 v105.68,31.88
N$37
  Top 0.305: Q2.B 92.6,34.22 R28.1
N$38
  Top 0.305: Q6.B 101.49,34.22 R32.2
N$39
  Top 0.305: Q2.C R32.1
N$40
  Top 0.305: SRC4.1 105.94,25.36 Q8.C
N$41
  Top 0.61: 76.18,33.1 76.22,33.15 76.22,31.9 | 76.22,31.9 F2.P$2 | 76.22,31.9 73.96,31.9 D10.C 72.45,31.87 L2.2
N$42
  Top 0.61: F1.P$2 76.47,37.19 76.47,38.23 76.43,38.18 74.02,38.18 D9.A 72.45,38.09 L1.2
N$44
  Top 0.305: Q4.B 92.6,27.11 R30.1
N$45
  Top 0.305: Q8.B 101.49,27.11 R34.2
N$46
  Top 0.305: CLK_IN.1 3.07,6.48 4.97,6.48 6.88,4.57 6.88,4.26 R12.1
N$47  (via drill 0.6)
  Top 0.305: R36.1 86.76,9.02 v85.62,7.87
  Bottom 0.305: v85.62,7.87 81.17,7.87 80.54,8.51 IC7.7
N$48
  Top 0.305: Q4.C R34.1
N$50
  Top 0.305: GATEIN.1 R11.1
N$53
  Top 0.305: CVIN2.1 3.07,11.56 3.07,13.46 3.7,14.1 5.93,14.1 R9.1
N$54
  Top 0.305: R9.2 VR1.E
N$55
  Top 0.305: VR1.A 16.36,14.37 R15.1
N$56
  Top 0.305: CVIN1.1 5.61,11.56 R10.1
N$57
  Top 0.305: R10.2 VR2.E
N$58
  Top 0.305: VR2.A 16.36,10.56 R16.1
N$60
  Top 0.305: IC8.1 IC8.2 92.98,14.73 93.62,14.1 93.62,13.08 92.86,12.32 92.86,8.26 95.9,5.21 R39.1
N$61
  Top 0.305: IC8.7 IC8.6 96.79,13.46 97.37,12.89 R38.1
N$63
  Top 0.61: POWER.9 POWER.10 81.55,36.96 F1.P$1
N$64  (via drill 0.6)
  Top 0.305: R39.2 v100.86,5.21
  Bottom 0.305: v100.86,5.21 101.49,5.21 102.76,3.94 104.67,3.94 TRGOUT.1
N$65
  Top 0.305: R38.2 99.59,7.75 100.86,6.48 104.67,6.48 CLKOUT.1
N$75
  Top 0.61: POWER.1 POWER.2 80.28,25.53 79.24,26.57 F2.P$1
SR_DATA  (via drill 0.6)
  Top 0.305: IC1.2 14.12,32.51 v14.75,31.88 | v39.01,28.7 IC2.17
  Bottom 0.305: v14.75,31.88 15.13,31.5 36.21,31.5 v39.01,28.7
SR_SHIFT  (via drill 0.6)
  Top 0.305: IC1.15 v17.04,32.51 | IC2.2 28.47,31.24 28.21,31.5 v28.21,32.51
  Bottom 0.305: v17.04,32.51 17.04,32.26 17.29,32 27.7,32 v28.21,32.51
SR_STORE  (via drill 0.6)
  Top 0.305: v28.21,29.97 IC2.3 | IC1.10 17.42,26.16 v16.78,26.8
  Bottom 0.305: v16.78,26.8 26.94,26.8 27.58,27.43 27.58,29.34 v28.21,29.97
SRC1
  Top 0.305: IC6.1 68.09,21.08 68.09,23.5 68.47,23.88 86.25,23.88 87.01,24.64 87.01,29.34 87.39,29.72 R29.2
SRC2  (via drill 0.6)
  Top 0.305: IC6.5 67.43,16.13 68.22,16.13 69.36,17.27 69.36,19.05 70,19.69 70,21.84 70.12,21.97 89.68,21.97 v90.32,22.61 | v88.16,36.83 R27.2
  Bottom 0.305: v90.32,22.61 90.32,34.67 v88.16,36.83
SRC3  (via drill 0.6)
  Top 0.305: IC6.2 68.47,19.81 68.73,20.07 68.73,22.99 | 68.73,22.99 68.73,23.11 68.85,23.24 | 68.73,22.99 68.98,23.24 87.78,23.24 v88.03,23.5 | v88.16,33.27 R28.2
  Bottom 0.305: v88.03,23.5 88.03,33.15 v88.16,33.27
SRC4
  Top 0.305: IC6.4 68.47,17.27 68.85,17.65 68.85,19.3 69.36,19.81 69.36,22.48 69.49,22.61 88.79,22.61 89.3,23.11 89.3,25.72 R30.2 89.68,26.1
SWITCH  (via drill 0.6)
  Top 0.305: v38.88,32.51 36.34,32.51 32.53,28.7 IC2.4 | v50.56,32.51 50.56,35.18 49.68,36.07 47.01,36.07 43.71,32.77 v43.71,32.51
  Bottom 0.305: v38.88,32.51 v43.71,32.51 43.71,27.05 50.95,19.81 64.79,19.81 67.71,16.89 88.41,16.89 90.32,14.99 92.73,14.99 102.51,5.21 SWITCH.1 | v50.56,32.51 J1.1
TRGOUT  (via drill 0.6)
  Top 0.305: IC8.3 v92.73,13.46 | v48.28,21.08 47.9,21.08 46.37,19.56 38.37,19.56 33.04,24.89 IC2.7
  Bottom 0.305: v92.73,13.46 90.95,13.46 88.16,16.26 67.46,16.26 64.53,19.18 50.69,19.18 48.79,21.08 v48.28,21.08

### Text on the board
bPlace: -12V | +12V